# EAGLE design M850A (EAGLE 6.6.0)
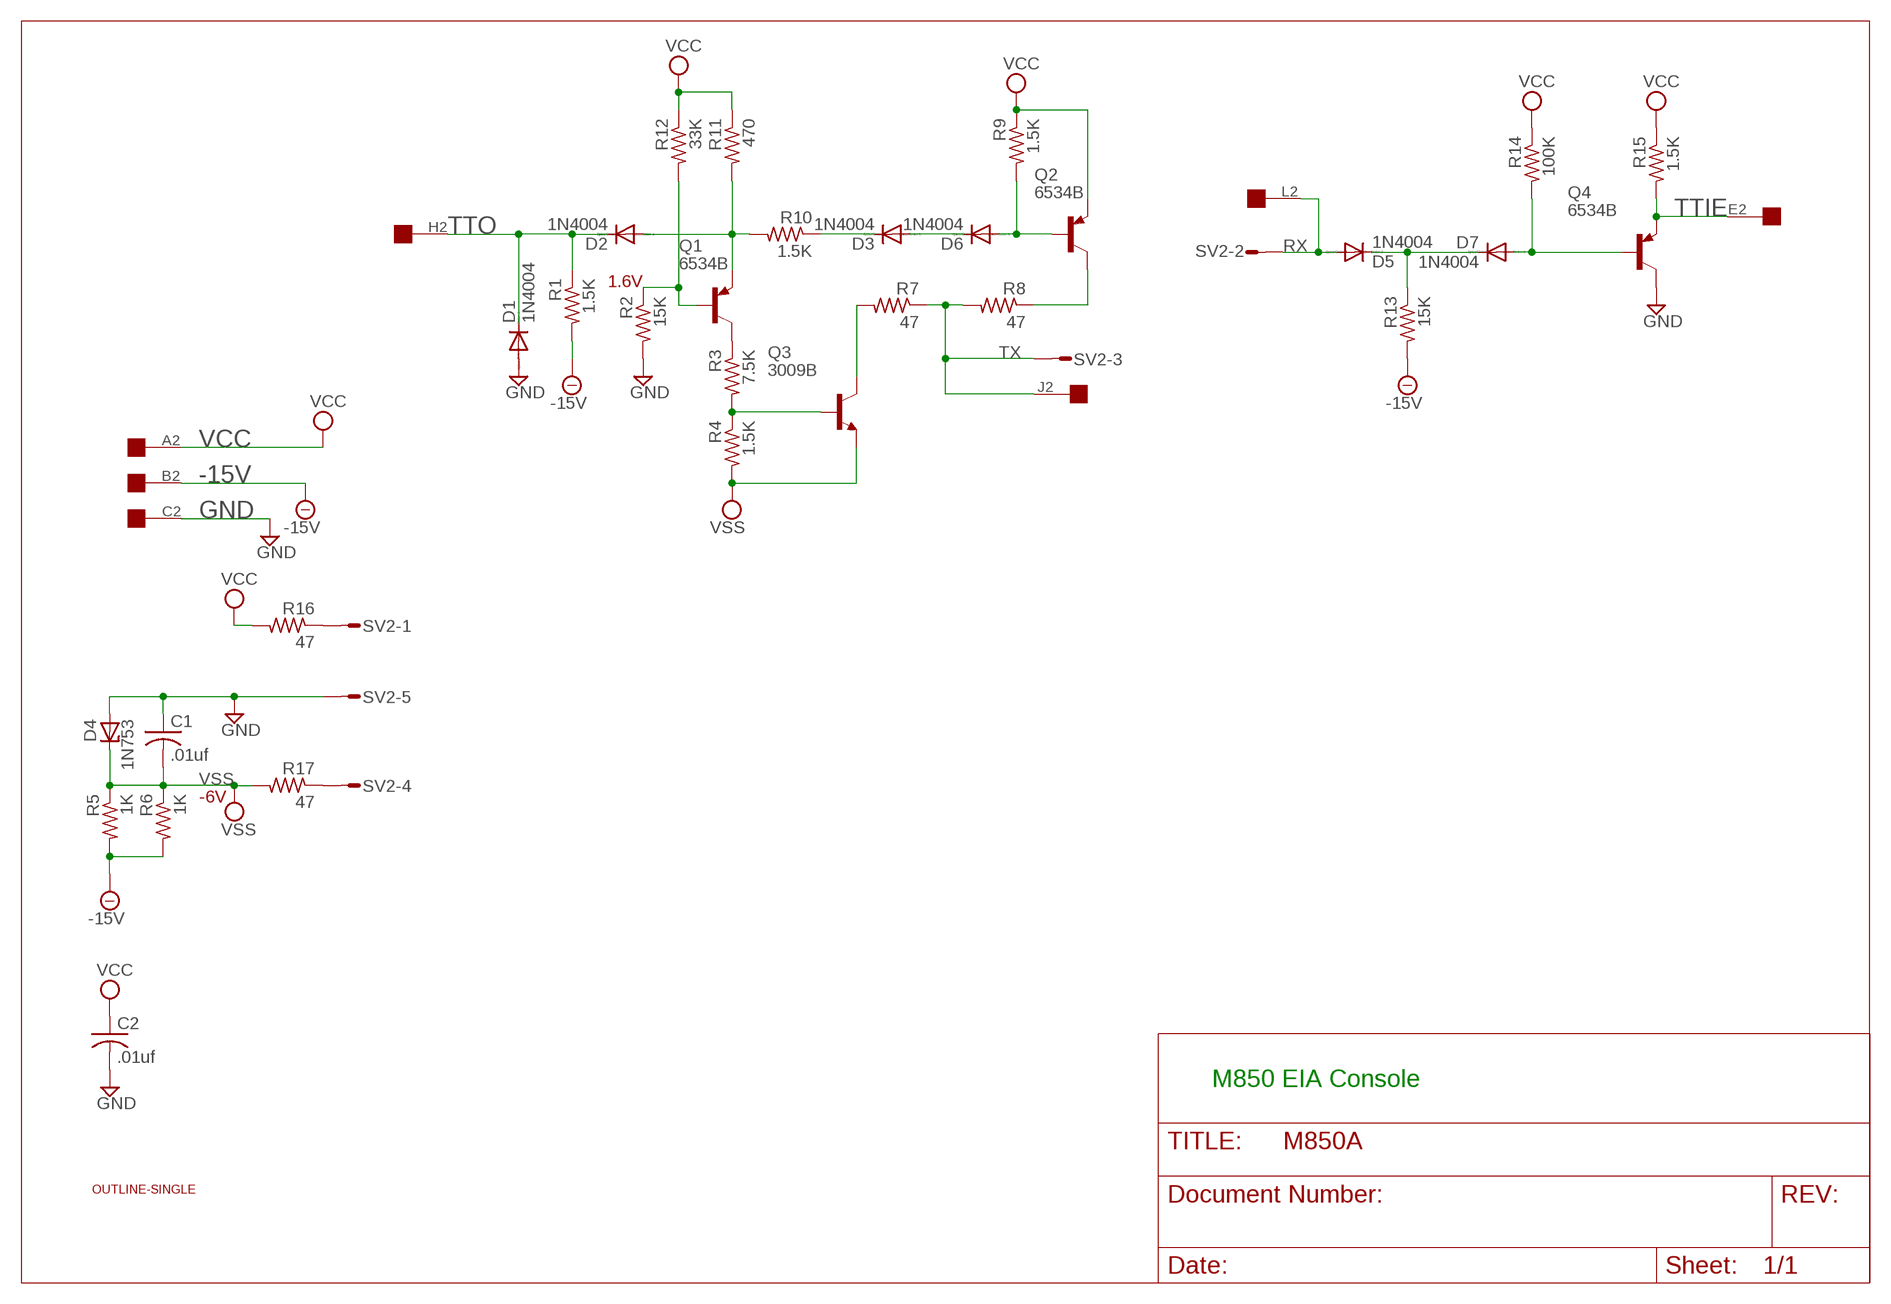
[diagram p0: schematic, sheet 1]

## Parts
C1  .01uf  C-US050-025X075  [C050-025X075]
C2  .01uf  C-US050-025X075  [C050-025X075]
D1  1N4004  1N4148DO35-10  [DO35-10]
D2  1N4004  1N4148DO35-10  [DO35-10]
D3  1N4004  1N4148DO35-10  [DO35-10]
D4  1N753  ZENER-DIODEDO35Z10  [DO35Z10]
D5  1N4004  1N4148DO35-10  [DO35-10]
D6  1N4004  1N4148DO35-10  [DO35-10]
D7  1N4004  1N4148DO35-10  [DO35-10]
EDGE  EDGE-1  [EDGE-CON1]
Q1  6534B  -PNP-TO92/  [TO92/]
Q2  6534B  -PNP-TO92/  [TO92/]
Q3  3009B  -NPN-TO18-  [TO18-]
Q4  6534B  -PNP-TO92/  [TO92/]
R1  1.5K  R-US_0207/10  [0207/10]
R2  15K  R-US_0207/10  [0207/10]
R3  7.5K  R-US_0207/10  [0207/10]
R4  1.5K  R-US_0207/10  [0207/10]
R5  1K  R-US_0207/10  [0207/10]
R6  1K  R-US_0207/10  [0207/10]
R7  47  R-US_0207/10  [0207/10]
R8  47  R-US_0207/10  [0207/10]
R9  1.5K  R-US_0207/10  [0207/10]
R10  1.5K  R-US_0207/10  [0207/10]
R11  470  R-US_0207/10  [0207/10]
R12  33K  R-US_0207/10  [0207/10]
R13  15K  R-US_0207/10  [0207/10]
R14  100K  R-US_0207/10  [0207/10]
R15  1.5K  R-US_0207/10  [0207/10]
R16  47  R-US_0207/10  [0207/10]
R17  47  R-US_0207/10  [0207/10]
SV2  L08P  [L08P]
U$1  OUTLINE-SINGLE  [SINGLE]

## Nets
-15V: EDGE.B2 R1.2 R5.2 R6.2 R13.2
GND: C1.1 C2.2 D1.A D4.A EDGE.C2 Q4.3(C) R2.2 SV2.5
N$1: Q2.3(C) R8.1
N$2: D7.A Q4.2(B) R14.2
N$4: Q1.3(C) R3.1
N$7: R17.1 SV2.4
N$8: Q3.3(C) R7.2
N$9: D5.C D7.C R13.1
N$10: D2.A Q1.1(E) R10.2 R11.2
N$11: D6.A Q2.2(B) R9.2
N$12: Q1.2(B) R2.1 R12.2
N$13: D3.A D6.C
N$14: D3.C R10.1
N$15: Q3.2(B) R3.2 R4.1
N$16: R16.1 SV2.1
RX: D5.A EDGE.L2 SV2.2
TTIE: EDGE.E2 Q4.1(E) R15.2
TTO: D1.C D2.C EDGE.H2 R1.1
TX: EDGE.J2 R7.1 R8.2 SV2.3
VCC: C2.1 EDGE.A2 Q2.1(E) R9.1 R11.1 R12.1 R14.1 R15.1 R16.2
VSS: C1.2 D4.C Q3.1(E) R4.2 R5.1 R6.1 R17.2
Unconnected: EDGE.D2 EDGE.F2 EDGE.K2 EDGE.M2 EDGE.N2 EDGE.P2 EDGE.R2 EDGE.S2 EDGE.T2 EDGE.U2 EDGE.V2 SV2.6 SV2.7 SV2.8

## Notes on the sheet
- 1.6V
- -6V
- M850 EIA Console

## Library data of the parts
C1 C2 = rcl:C-US: CAPACITOR, American symbol
D1-D3 D5-D7 = diode:1N4148: DIODE high speed (Philips)
D4 = diode:ZENER-DIODE: Z-Diode
EDGE = dec-con:EDGE-1: Single-Sided DEC Edge Connector -- (side 2)
Q1 Q2 Q4 = transistor:*-PNP-: PNP Transistror
Q3 = transistor:*-NPN-: NPN Transistror BF959 corrected 2008.03.06
R1-R17 = rcl:R-US_: RESISTOR, American symbol
SV2 = con-amp-mt:L08P: AMP MT CONNECTOR; OC_FARNELL: unknown; OC_NEWARK: unknown
U$1 = dec-con:OUTLINE-*: Board outlines for DEC boards.

## Board
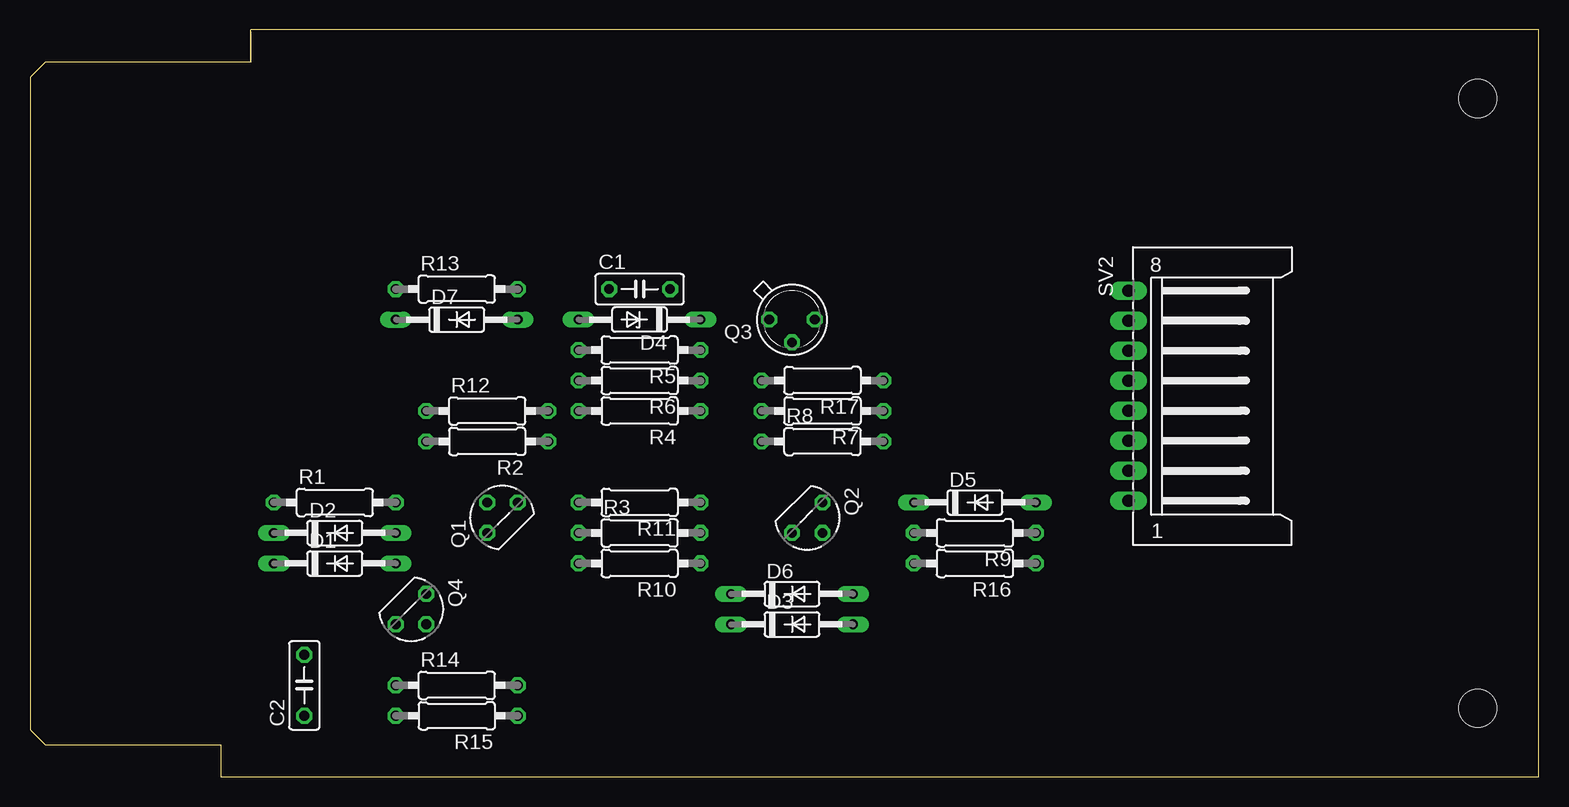
[diagram p1: board, top side]
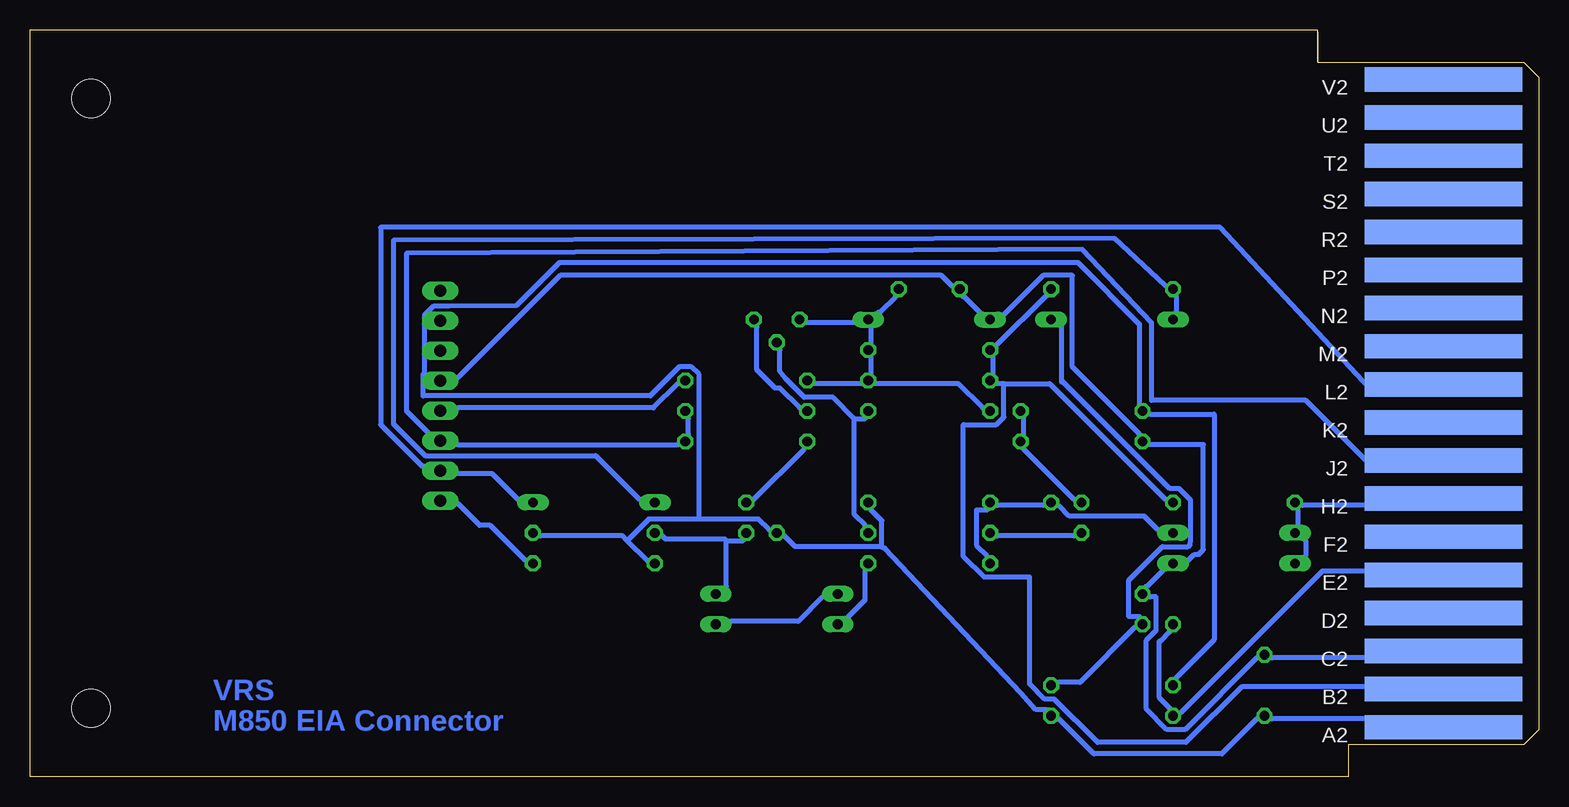
[diagram p2: board, bottom side, seen from below]

Size 125.73 x 62.23 mm. Coordinates in mm from the lower left corner, seen from the top.
Copper layers (1+16): Top 0.035mm / dielectric 1.5mm / Bottom 0.035mm
Design rules "16mils": minimum track width 16mil, minimum drill 32mil, track to track 15mil, track to pad 10mil, pad to pad 10mil, via to via 10mil, smd to smd 10mil, copper to edge 13mil, drill to drill 10mil, minimum pad ring 10mil, minimum via ring 8mil, stop-mask expansion 0mil, vias tented up to drill 0mil, thermal gap 10mil

### Footprints (pad centres in the part's own frame; a part is rotated, then mirrored left to right if it is on the bottom)
C050-025X075 = drill 0.813 octagon: 1 -2.54,0; 2 2.54,0
DO35-10 = drill 0.813 long: A 5.08,0; C -5.08,0
DO35Z10 = drill 0.813 long: A 5.08,0; C -5.08,0
EDGE-CON1 = smd 13.106 x 2.032 bottom: A2 7.938,4.128; B2 7.938,7.303; C2 7.938,10.477; D2 7.938,13.652; E2 7.938,16.828; F2 7.938,20.003; H2 7.938,23.177; J2 7.938,26.352; K2 7.938,29.527; L2 7.938,32.703; M2 7.938,35.877; N2 7.938,39.053; P2 7.938,42.227; R2 7.938,45.403; S2 7.938,48.578; T2 7.938,51.752; U2 7.938,54.928; V2 7.938,58.102
TO92/ = drill 0.813 octagon: 1 1.27,-1.27; 2 1.27,1.27; 3 -1.27,1.27
TO18- = drill 0.813 octagon: 1 1.905,0; 2 0,1.905; 3 -1.905,0
0207/10 = drill 0.813 octagon: 1 -5.08,0; 2 5.08,0
L08P = drill 1.016 long: 1 8.75,-6.25; 2 6.25,-6.25; 3 3.75,-6.25; 4 1.25,-6.25; 5 -1.25,-6.25; 6 -3.75,-6.25; 7 -6.25,-6.25; 8 -8.75,-6.25
SINGLE = hole 3.175: 120.65,56.515; 120.65,5.715

### Placement (x,y rotation side)
C1  50.8,40.64 0 top
C2  22.86,7.62 90 top
D1  25.4,17.78 0 top
D2  25.4,20.32 0 top
D3  63.5,12.7 0 top
D4  50.8,38.1 180 top
D5  78.74,22.86 0 top
D6  63.5,15.24 0 top
D7  35.56,38.1 0 top
EDGE  0,0 0 top
Q1  39.37,21.59 90 top
Q2  64.77,21.59 270 top
Q3  63.5,38.1 180 top
Q4  31.75,13.97 270 top
R1  25.4,22.86 0 top
R2  38.1,27.94 180 top
R3  50.8,20.32 0 top
R4  50.8,30.48 180 top
R5  50.8,35.56 180 top
R6  50.8,33.02 180 top
R7  66.04,30.48 180 top
R8  66.04,27.94 0 top
R9  78.74,20.32 180 top
R10  50.8,17.78 180 top
R11  50.8,22.86 180 top
R12  38.1,30.48 0 top
R13  35.56,40.64 0 top
R14  35.56,7.62 0 top
R15  35.56,5.08 180 top
R16  78.74,17.78 180 top
R17  66.04,33.02 180 top
SV2  97.79,31.75 270 top
U$1  0,0 0 top

### Tracks (layer width: path | path; a pad name or v marks a point on that pad's centre or on a via)
-15V
  Bottom 0.406: 44.58,32.77 40.77,32.77 31.12,23.11 R1.2 | 44.58,32.77 45.09,32.77 R6.2 45.47,33.66 45.47,34.92 R5.2 45.21,35.94 41.02,40.13 R13.2 | EDGE.B2 12.83,7.62 12.95,7.49 24.77,7.49 29.4,2.86 36.77,2.86 40.39,6.48 41.15,6.48 42.42,7.75 42.42,16.64 46.23,16.64 47.94,18.35 47.94,29.34 45.21,29.34 44.58,29.97 44.58,32.77
GND
  Bottom 0.406: EDGE.C2 14.1,9.91 22.23,9.91 C2.2 23.5,9.91 29.46,3.94 30.99,3.94 32.7,5.65 32.7,11.37 31.88,12.19 31.88,14.99 32.39,14.99 Q4.3 32.77,15.88 32.64,15.88 31.37,17.14 D1.A 29.21,18.03 28.7,18.54 28.32,18.54 27.94,18.92 27.94,27.69 32.39,27.69 R2.2 33.27,28.57 38.86,34.16 38.86,41.78 41.28,41.78 44.58,38.48 D4.A 46.61,38.73 47.88,40.01 48.01,40.01 C1.1 48.9,40.89 49.78,41.78 81.53,41.78 90.04,33.27 SV2.5
N$1
  Bottom 0.406: R8.1 61.21,27.3 65.41,23.11 Q2.3
N$2
  Bottom 0.406: R14.2 40.01,7.87 38.23,7.87 33.66,12.45 Q4.2 33.27,13.34 34.16,13.34 34.16,16.38 31.37,19.18 29.21,19.18 29.08,19.3 29.02,19.62 29.02,23.05 29.97,24 30.73,24 39.62,32.89 39.75,32.89 39.75,37.47 D7.A
N$4
  Bottom 0.406: Q1.3 38.74,20.07 45.09,20.07 R3.1
N$7
  Bottom 0.406: R17.1 71.76,32.77 73.79,30.73 90.04,30.73 SV2.4
N$8
  Bottom 0.406: R7.2 61.6,30.73 63.25,32.38 63.63,32.38 65.15,33.91 65.15,37.47 Q3.3
N$9
  Bottom 0.406: D7.C 30.23,38.73 30.23,40.01 R13.1 31.12,40.92 35.38,44.86 95.44,44.7 95.44,29.4 92.81,26.77 78.59,26.77 74.96,23.14 D5.C
N$10
  Bottom 0.406: R10.2 45.97,18.41 46.86,19.3 46.86,22.23 45.97,22.23 R11.2 45.09,22.61 41.28,22.61 Q1.1 40.01,22.61 39.12,21.72 32.89,21.72 31.75,20.57 D2.A
N$11
  Bottom 0.406: 67.69,19.68 67.69,15.88 D6.A | 67.69,19.68 66.29,19.68 Q2.2 | R9.2 73.03,20.07 72.77,19.81 67.82,19.81 67.69,19.68
N$12
  Bottom 0.406: Q1.2 38.74,23.11 42.93,27.3 R2.1 42.93,28.57 42.93,29.84 R12.2
N$13
  Bottom 0.406: D6.C 59.69,14.99 61.72,12.95 67.31,12.95 D3.A
N$14
  Bottom 0.406: D3.C 57.53,13.34 56.13,14.73 56.13,17.14 R10.1
N$15
  Bottom 0.406: 57.02,29.84 57.02,21.84 56.13,20.95 R3.2 | 57.02,29.84 56.13,29.84 R4.1 | Q3.2 63.25,35.56 63.25,33.78 62.74,33.15 61.21,31.62 58.8,31.62 57.02,29.84
N$16
  Bottom 0.406: R16.1 84.46,18.03 87.38,20.95 88.27,20.95 90.04,22.73 SV2.1
RX
  Bottom 0.406: D5.A 85.09,23.11 87.25,25.27 90.04,25.27 SV2.2 92.96,25.91 93.09,25.91 96.52,29.34 96.52,45.78 26.54,45.78 14.1,32.38 EDGE.L2
TTIE
  Bottom 0.406: Q4.1 30.73,12.06 31.5,11.3 31.62,11.3 31.62,6.6 30.73,5.71 R15.2 29.85,5.33 18.03,17.14 12.83,17.14 EDGE.E2
TTO
  Bottom 0.406: D1.C 19.43,18.41 19.43,19.68 D2.C 20.07,20.95 20.07,22.23 R1.1 19.69,22.61 14.1,22.61 EDGE.H2
TX
  Bottom 0.406: R7.1 70.87,29.84 70.87,28.57 R8.2 71.76,27.69 90.04,27.69 SV2.3 92.58,28.7 94.36,30.48 94.36,43.62 38.04,43.94 32.26,37.85 32.26,31.37 19.43,31.37 14.1,26.04 EDGE.J2
VCC
  Bottom 0.406: EDGE.A2 14.1,4.83 22.23,4.83 C2.1 23.5,4.83 26.42,1.91 37.08,1.91 40.01,4.83 R15.1 41.02,5.59 41.91,5.59 43.18,6.99 54.48,19.05 54.61,19.05 54.74,19.18 | R14.1 30.23,8.26 27.05,11.43 27.05,30.23 32.39,30.23 R12.1 33.27,31.11 33.27,37.72 38.42,42.86 81.6,42.86 85.15,39.31 90.81,39.24 92.08,39.24 92.84,38.48 92.84,33.66 92.96,33.53 92.96,31.75 74.04,31.75 71.63,34.16 70.61,34.16 69.98,33.53 69.98,21.46 | 54.74,19.18 54.74,21.34 55.63,22.23 R11.1 | 54.74,19.18 61.98,19.18 62.87,20.07 Q2.1 64.14,20.57 65.02,21.46 69.98,21.46 | 75.95,19.68 76.33,20.07 83.19,20.07 R9.1 | 75.95,19.68 74.3,18.03 R16.2 | 69.98,21.46 74.17,21.46 75.95,19.68
VSS
  Bottom 0.406: R4.2 46.36,30.73 48.39,32.77 55.25,32.77 R6.1 | R6.1 55.63,33.66 55.63,34.92 R5.1 55.63,36.2 55.63,37.47 D4.C | R17.2 60.33,32.77 56.52,32.77 R6.1 | Q3.1 60.96,37.85 57.15,37.85 D4.C | C1.2 53.59,40.01 54.86,38.73 54.99,38.73 D4.C

### Text on the board
Bottom: VRS | M850 EIA Connector